# Altium schematic sheet MosDrive.SchDoc
size A
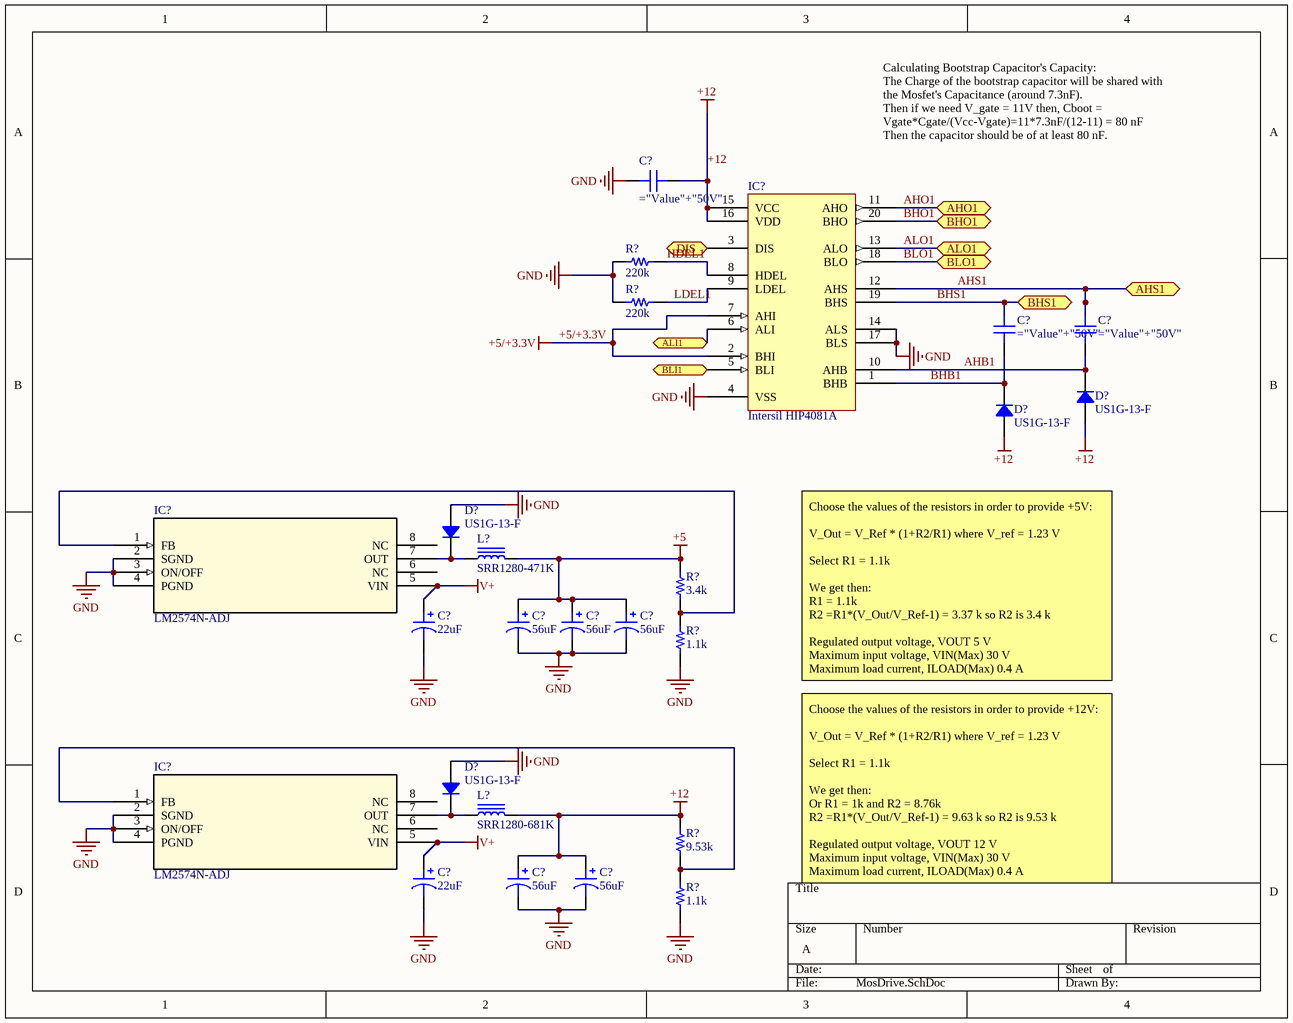
[diagram p0: MosDrive.SchDoc]

## Parts
(Parts that share a designator on the sheet are numbered #1, #2 ... from top to bottom, then left to right.)
C?#1  (no value)  [CAP 1812/4532 1.1MM]
C?#2  (no value)  [CAP 1812/4532 1.1MM]
C?#3  (no value)  [CAP 1812/4532 1.1MM]
C?#4  22uF  [CAP ALUM 8.3MM]
C?#5  56uF  [CAP ALUM 8.3MM]
C?#6  56uF  [CAP ALUM 8.3MM]
C?#7  56uF  [CAP ALUM 8.3MM]
C?#8  22uF  [CAP ALUM 8.3MM]
C?#9  56uF  [CAP ALUM 8.3MM]
C?#10  56uF  [CAP ALUM 8.3MM]
D?#1  US1G-13-F  [DO214AC SMA]
D?#2  US1G-13-F  [DO214AC SMA]
D?#3  US1G-13-F  [DO214AC SMA]
D?#4  US1G-13-F  [DO214AC SMA]
IC?#1  Intersil HIP4081A  [INTERSIL SOIC-20 WIDE]
IC?#2  LM2574N-ADJ  [DIP8]
IC?#3  LM2574N-ADJ  [DIP8]
L?#1  SRR1280-471K  [BOURNS SRR1280]
L?#2  SRR1280-681K  [BOURNS SRR1280]
R?#1  220k  [RES 0603/1608]
R?#2  220k  [RES 0603/1608]
R?#3  3.4k  [RES 1206/3216]
R?#4  1.1k  [RES 1206/3216]
R?#5  9.53k  [RES 1206/3216]
R?#6  1.1k  [RES 1206/3216]

## Ports
AHO1, AHS1, ALI1, ALO1, BHO1, BHS1, BLI1, BLO1, DIS

## Nets
+5: C?#5.1 C?#6.1 C?#7.1 L?#1.2 R?#3.2
+5/+3.3V: IC?#1.2(BHI) IC?#1.7(AHI)
+12: C?#1.2 C?#9.1 C?#10.1 D?#1.1 D?#2.1 IC?#1.15(VCC) IC?#1.16(VDD) L?#2.2 R?#5.2
GND: C?#1.1 C?#4.2 C?#5.2 C?#6.2 C?#7.2 C?#8.2 C?#9.2 C?#10.2 D?#3.1 D?#4.1 IC?#1.4(VSS) IC?#1.14(ALS) IC?#1.17(BLS) IC?#2.2(SGND) IC?#2.3(ON/OFF) IC?#2.4(PGND) IC?#3.2(SGND) IC?#3.3(ON/OFF) IC?#3.4(PGND) R?#1.1 R?#2.1 R?#4.2 R?#6.2
V+: C?#4.1 C?#8.1 IC?#2.5(VIN) IC?#3.5(VIN)
AHB1: C?#3.1 D?#1.2 IC?#1.10(AHB)
AHO1: IC?#1.11(AHO) ; port AHO1
AHS1: C?#3.2 IC?#1.12(AHS) ; port AHS1
ALI1: IC?#1.6(ALI) ; port ALI1
ALO1: IC?#1.13(ALO) ; port ALO1
BHB1: C?#2.1 D?#2.2 IC?#1.1(BHB)
BHO1: IC?#1.20(BHO) ; port BHO1
BHS1: C?#2.2 IC?#1.19(BHS) ; port BHS1
BLI1: IC?#1.5(BLI) ; port BLI1
BLO1: IC?#1.18(BLO) ; port BLO1
DIS: IC?#1.3(DIS) ; port DIS
HDEL1: IC?#1.8(HDEL) R?#1.2
LDEL1: IC?#1.9(LDEL) R?#2.2
NetD?#3_2: D?#3.2 IC?#2.7(OUT) L?#1.1
NetD?#4_2: D?#4.2 IC?#3.7(OUT) L?#2.1
NetIC?#2_1: IC?#2.1(FB) R?#3.1 R?#4.1
NetIC?#3_1: IC?#3.1(FB) R?#5.1 R?#6.1

Not connected (* = marked no-connect by the designer): IC?#2 6(NC) 8(NC); IC?#3 6(NC) 8(NC)

## Notes on the sheet
- (near IC?#1) Calculating Bootstrap Capacitor's Capacity:
  The Charge of the bootstrap capacitor will be shared with the Mosfet's Capacitance (around 7.3nF).
  Then if we need V_gate = 11V then, Cboot = Vgate*Cgate/(Vcc-Vgate)=11*7.3nF/(12-11) = 80 nF
  Then the capacitor should be of at least 80 nF.
- Choose the values of the resistors in order to provide +5V:
  V_Out = V_Ref * (1+R2/R1) where V_ref = 1.23 V
  Select R1 = 1.1k
  We get then:
  R1 = 1.1k
  R2 =R1*(V_Out/V_Ref-1) = 3.37 k so R2 is 3.4 k
  Regulated output voltage, VOUT 5 V
  Maximum input voltage, VIN(Max) 30 V
  Maximum load current, ILOAD(Max) 0.4 A
  Switching frequency, F 52 kHz
  Calculating the inductance:
  ExT = (Vin-Vout)*Vout/Vin*1000/F (kHz) = (V*us) = 80.13 V*us
  Check Figure 32 of datasheet
  We get inductance region of 470 uH
  Recommended by TI: PE-52628 (MSS1278-474KLD ou
  Calculating the capacitors of Out:
  According to the datasheet:
  C_out >= 13300*Vin(max)/(V_out*L(uh)) in uF = 13300*30*1/12*1/680 =49 uF
  But V_ripple about Iload/(2*F*C) we want V_ripple about 1% of 12 V C = Iload/(2*F*V_ripple) = 0.4/(2*52e3*0.01*12) = 32 uF
  Thus 49 or 50 uF should be enough for the ripple current. But to be safe let's go with 22*5 uF = 110 uF.
  Vrating = 1.5 Vout = 18 V
- Choose the values of the resistors in order to provide +12V:
  V_Out = V_Ref * (1+R2/R1) where V_ref = 1.23 V
  Select R1 = 1.1k
  We get then:
  Or R1 = 1k and R2 = 8.76k
  R2 =R1*(V_Out/V_Ref-1) = 9.63 k so R2 is 9.53 k
  Regulated output voltage, VOUT 12 V
  Maximum input voltage, VIN(Max) 30 V
  Maximum load current, ILOAD(Max) 0.4 A
  Switching frequency, F 52 kHz
  Calculating the inductance:
  ExT = (Vin-Vout)*Vout/Vin*1000/F (kHz) = (V*us) = 138.5 V*us
  Check Figure 32 of datasheet
  We get inductance region of 680 uH
  Recommended by TI: PE-52629NL
  Calculating the capacitors of Out:
  According to the datasheet:
  C_out >= 13300*Vin(max)/(V_out*L(uh)) in uF = 13300*30*1/12*1/680 =49 uF
  But V_ripple about Iload/(2*F*C) we want V_ripple about 1% of 12 V C = Iload/(2*F*V_ripple) = 0.4/(2*52e3*0.01*12) = 32 uF
  Thus 49 or 50 uF should be enough for the ripple current. But to be safe let's go with 22*5 uF = 110 uF.
  Vrating = 1.5 Vout = 18 V

## Library data of the parts
C?#1-C?#3 = C1812C474K5RACTU: Ceramic, Commercial-(CxxxxC), 0.47 uF, 10%, 50 V,; Manufacturer: Kemet; Value: 0.47uF; TemperatureRange: -55°C ~ 125°C; TemperatureCoefficient: X7R; Voltage: 50V; Part Number: C1812C474K5RACTU; PartId: 21099; Supplier 1: Digi-Key; Supplier Part Number 1: 399-3454-1-ND; ComponentLink1Description: Datasheet; ComponentLink1URL: http://www.kemet.com/docfinder?Partnumber=C1812C474K5RACTU; ComponentLink2Description: Digi-Key Listing; ComponentLink2URL: https://www.digikey.com/product-detail/en/kemet/C1812C474K5RACTU/399-3454-1-ND/721325; Tolerance: 10%; Price: 0.97; Device Package: 1812 (4532 Metric)
C?#4 C?#8 = UWX1H220MCL1GB: CAP ALUM 22UF 20% 50V SMD; Manufacturer: Nichicon; TemperatureRange: -40C ~ 85C; Type: General Purpose; Ripple Current: 52mA; Lifetime @ Temp: 2000 Hrs @ 85C; Value: 22uF; Part Number: UWX1H220MCL1GB; PartId: 7298; Supplier 1: Digi-Key; Supplier Part Number 1: 493-2136-2-ND; ComponentLink1Description: Datasheet; ComponentLink1URL: http://nichicon-us.com/english/products/pdfs/e-wx.pdf; ComponentLink2Description: Digi-Key listing; ComponentLink2URL: http://digikey.com/product-detail/en/UWX1H220MCL1GB/493-2136-2-ND/589877; Tolerance: 20%; Voltage: 50V; Price: 0.1154; Device Package: Radial, Can - SMD; Impedance: -
C?#5-C?#7 C?#9 C?#10 = UUD1H560MNL1GS: CAP ALUM 56UF 20% 50V SMD; Manufacturer: Nichicon; TemperatureRange: -55C ~ 105C; Type: General Purpose; Ripple Current: 300mA; Impedance: 340 mOhm; Lifetime @ Temp: 5000 Hrs @ 105C; Value: 56uF; Part Number: UUD1H560MNL1GS; PartId: 7356; Supplier 1: Digi-Key; Supplier Part Number 1: 493-2304-2-ND; ComponentLink1Description: Datasheet; ComponentLink1URL: http://nichicon-us.com/english/products/pdfs/e-ud.pdf; ComponentLink2Description: Digi-Key listing; ComponentLink2URL: http://digikey.com/product-detail/en/UUD1H560MNL1GS/493-2304-2-ND/590045; Tolerance: 20%; Voltage: 50V; Price: 0.3417; Device Package: Radial, Can - SMD
D?#1-D?#4 = US1G-13-F: DIODE GEN PURP 400V 1A SMA; Manufacturer: Diodes Incorporated; Type: Standard; Current Reverse Leakage @ Vr: 5uA @ 400V; Reverse Recovery Time (trr): 50ns; Voltage Forward (Vf): 1.3V @ 1A; Part Number: US1G-13-F; PartId: 16329; Supplier 1: Digi-Key; Supplier Part Number 1: US1G-FDITR-ND; ComponentLink1Description: Datasheet; ComponentLink1URL: http://www.diodes.com/_files/datasheets/ds16008.pdf; ComponentLink2Description: Digi-Key Listing; ComponentLink2URL: https://www.digikey.com/product-detail/en/diodes-incorporated/US1G-13-F/US1G-FDITR-ND/814656; Junction Operating Temperature: -65C ~ 150C; Price: 0.0935; Device Package: DO-214AC, SMA; Voltage DC Reverse (Vr): 400V; Current Rectified: 1A
IC?#2 IC?#3 = LM2574N-ADJ: IC Switched Adjustable Regulator Through hole 1.23; Manufacturer_Part_Number: lm2574n-adjnopb; Manufacturer: Texas Instruments; Vendor: National Semiconductor; Function: Step-Down; Output Configuration: Positive; Topology: Buck; Number Of Outputs: 1; Voltage - Input (Min): 4V; Voltage - Input (Max): 40V; Voltage - Output (Min/Fixed): 1.23V; Voltage - Output (Max): 37V; Current Output: 500mA; Frequency - Switching: 52kHz; Synchronous Rectifier: No; Value: Value; Type: DC DC Adjustable Switching Regulators; RefDes: RefDes; Part Number: LM2574N-ADJ; PartId: 16767; Supplier 1: Digi-Key; Supplier Part Number 1: LM2574N-ADJ/NOPB-ND; ComponentLink1Description: Datasheet; ComponentLink1URL: http://www.ti.com/lit/ds/symlink/lm2574.pdf; ComponentLink2Description: Digi-Key Listing; ComponentLink2URL: https://www.digikey.com/product-detail/en/texas-instruments/LM2574N-ADJ-NOPB/LM2574N-ADJ-NOPB-ND/212614; Device Package: DPI 8; Price: 2.76; Series: SIMPLE SWITCHER®; Operating Temperature: -40°C ~ 125°C (TJ); Output Type: Adjustable
L?#1 = SRR1280-471K: FIXED IND 470UH 900MA 880 MOHM; Manufacturer: Bourns Inc.; Type: Wirewound; Material - Core: Ferrite; Tolerance: 10%; Current - Saturation: 1.25A; Shielding: Shielded; DC Resistance (DCR): 880 mOhm Max; Q @ Freq: 20 @ 796kHz; Frequency - Self Resonant: 2.2MHz; Value: 470uH; Part Number: SRR1280-471K; PartId: 15720; Supplier 1: Digi-Key; Supplier Part Number 1: SRR1280-471KLTR-ND; ComponentLink1Description: Datasheet; ComponentLink1URL: http://www.bourns.com/docs/Product-Datasheets/SRR1280.pdf; ComponentLink2Description: Digi-Key Listing; ComponentLink2URL: https://www.digikey.com/product-detail/en/bourns-inc/SRR1280-471K/SRR1280-471KLTR-ND/1970012; Price: 0.7737; Device Package: Nonstandard; Series: SRR1280; Inductance: 470uH; Current Rating: 900mA; Operating Temperature: -40C ~ 125C
L?#2 = SRR1280-681K: FIXED IND 680UH 750MA 1.3 OHM; Manufacturer: Bourns Inc.; Type: Wirewound; Material - Core: Ferrite; Tolerance: 10%; Current - Saturation: 970mA; Shielding: Shielded; DC Resistance (DCR): 1.3 Ohm Max; Q @ Freq: 26 @ 796kHz; Frequency - Self Resonant: 1.7MHz; Value: 680uH; Part Number: SRR1280-681K; PartId: 15724; Supplier 1: Digi-Key; Supplier Part Number 1: SRR1280-681KLTR-ND; ComponentLink1Description: Datasheet; ComponentLink1URL: http://www.bourns.com/docs/Product-Datasheets/SRR1280.pdf; ComponentLink2Description: Digi-Key Listing; ComponentLink2URL: https://www.digikey.com/product-detail/en/bourns-inc/SRR1280-681K/SRR1280-681KLTR-ND/1970014; Price: 0.7737; Device Package: Nonstandard; Series: SRR1280; Inductance: 680uH; Current Rating: 750mA; Operating Temperature: -40C ~ 125C
R?#1 R?#2 = ERJ-PA3J224V: RES SMD 220K OHM 5% 1/4W 0603; Manufacturer: Panasonic Electronic Components; TemperatureRange: -55C ~ 155C; TemperatureCoefficient: 200ppm/C; PowerRating: 0.25W, 1/4W; Value: 220k; Part Number: ERJ-PA3J224V; PartId: 11334; Supplier 1: Digi-Key; Supplier Part Number 1: P220KBZTR-ND; ComponentLink1Description: Datasheet; ComponentLink1URL: //media.digikey.com/pdf/Data%20Sheets/Panasonic%20Electronic%20Components/ERJ_PA2_P03_PA3_P06_P08_P14.pdf; ComponentLink2Description: Digi-Key Listing; ComponentLink2URL: https://www.digikey.com/product-detail/en/panasonic-electronic-components/ERJ-PA3J224V/P220KBZTR-ND/5036020; Tolerance: 5%; Price: 0.0115; Device Package: 0603 (1608 Metric)
R?#3 = ERA-8AEB3401V: RES SMD 3.4K OHM 0.1% 1/4W 1206; Manufacturer: Panasonic Electronic Components; TemperatureRange: -55C ~ 155C; TemperatureCoefficient: 25ppm/C; PowerRating: 0.25W, 1/4W; Value: 3.4k; Part Number: ERA-8AEB3401V; PartId: 3555; Supplier 1: Digi-Key; Supplier Part Number 1: P3.4KBCTR-ND; ComponentLink1Description: Datasheet; ComponentLink1URL: http://industrial.panasonic.com/lecs/www-data/pdf/AOA0000/AOA0000CE26.pdf; ComponentLink2Description: Digi-Key listing; ComponentLink2URL: http://digikey.com/product-detail/en/ERA-8AEB3401V/P3.4KBCTR-ND/3070974; Tolerance: 0.1%; Price: 0.1954; Type: Thin Film; Device Package: 1206 (3216 Metric)
R?#4 R?#6 = ERJ-8ENF1101V: RES SMD 1.1K OHM 1% 1/4W 1206; Manufacturer: Panasonic Electronic Components; TemperatureRange: -55C ~ 155C; TemperatureCoefficient: 100ppm/C; PowerRating: 0.25W, 1/4W; Value: 1.1k; Part Number: ERJ-8ENF1101V; PartId: 3127; Supplier 1: Digi-Key; Supplier Part Number 1: P1.10KFTR-ND; ComponentLink1Description: Datasheet; ComponentLink1URL: http://industrial.panasonic.com/www-cgi/jvcr13pz.cgi?E+PZ+3+AOA0002+ERJ8ENF1101V+7+WW; ComponentLink2Description: Digi-Key listing; ComponentLink2URL: http://digikey.com/product-detail/en/ERJ-8ENF1101V/P1.10KFTR-ND/88871; Tolerance: 1%; Price: 0.0093; Type: Thick Film; Device Package: 1206 (3216 Metric)
R?#5 = ERJ-8ENF9531V: RES SMD 9.53K OHM 1% 1/4W 1206; Manufacturer: Panasonic Electronic Components; TemperatureRange: -55C ~ 155C; TemperatureCoefficient: 100ppm/C; PowerRating: 0.25W, 1/4W; Value: 9.53k; Part Number: ERJ-8ENF9531V; PartId: 3197; Supplier 1: Digi-Key; Supplier Part Number 1: P9.53KFTR-ND; ComponentLink1Description: Datasheet; ComponentLink1URL: http://industrial.panasonic.com/www-cgi/jvcr13pz.cgi?E+PZ+3+AOA0002+ERJ8ENF9531V+7+WW; ComponentLink2Description: Digi-Key listing; ComponentLink2URL: http://digikey.com/product-detail/en/ERJ-8ENF9531V/P9.53KFTR-ND/89055; Tolerance: 1%; Price: 0.0093; Type: Thick Film; Device Package: 1206 (3216 Metric)